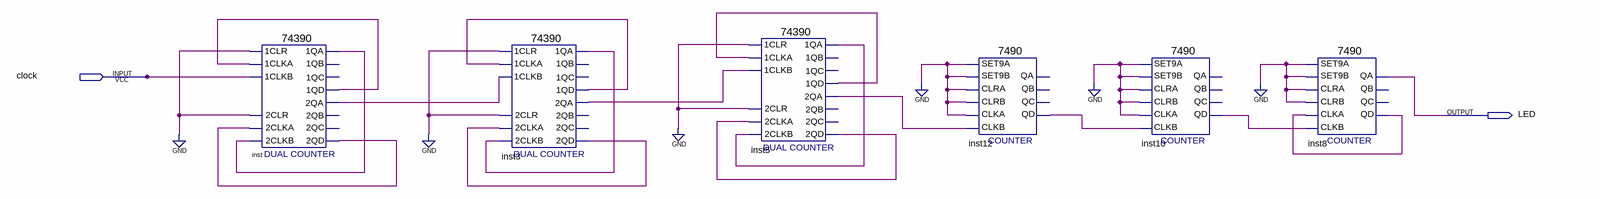
[diagram p0: schematic sheet]
// Quartus schematic Div02Hz5s.bdf as structural Verilog: 6 symbols, 2 pins
module Div02Hz5s (
  input  clock,
  output LED
);

  wire inst3_1qa, inst3_1qd, inst3_2qa, inst3_2qd, inst5_1qa, inst5_1qd, inst5_2qa, inst5_2qd, inst8_qd,
       inst10_qd, inst12_qd, inst_1qa, inst_1qd, inst_2qa, inst_2qd;

  \74390  inst (
    .\2CLKA (inst_2qd), .\2CLR (1'b0), .\2CLKB (inst_1qa), .\1CLR (1'b0), .\1CLKA (inst_1qd),
    .\1CLKB (clock), .\1QA (inst_1qa), .\1QD (inst_1qd), .\2QA (inst_2qa), .\2QD (inst_2qd));  // open: 1QB, 1QC, 2QB, 2QC
  \74390  inst3 (
    .\2CLKA (inst3_2qd), .\2CLR (1'b0), .\2CLKB (inst3_1qa), .\1CLR (1'b0), .\1CLKA (inst3_1qd),
    .\1CLKB (inst_2qa), .\1QA (inst3_1qa), .\1QD (inst3_1qd), .\2QA (inst3_2qa), .\2QD (inst3_2qd));  // open: 1QB, 1QC, 2QB, 2QC
  \74390  inst5 (
    .\2CLKA (inst5_2qd), .\2CLR (1'b0), .\2CLKB (inst5_1qa), .\1CLR (1'b0), .\1CLKA (inst5_1qd),
    .\1CLKB (inst3_2qa), .\1QA (inst5_1qa), .\1QD (inst5_1qd), .\2QA (inst5_2qa), .\2QD (inst5_2qd));  // open: 1QB, 1QC, 2QB, 2QC
  \7490  inst12 (
    .SET9A(1'b0), .CLRA(1'b0), .SET9B(1'b0), .CLKB(inst5_2qa), .CLKA(1'b0), .CLRB(1'b0), .QD(inst12_qd));  // open: QA, QB, QC
  \7490  inst10 (
    .SET9A(1'b0), .CLRA(1'b0), .SET9B(1'b0), .CLKB(inst12_qd), .CLKA(1'b0), .CLRB(1'b0), .QD(inst10_qd));  // open: QA, QB, QC
  \7490  inst8 (
    .SET9A(1'b0), .CLRA(1'b0), .SET9B(1'b0), .CLKB(inst10_qd), .CLKA(inst8_qd), .CLRB(1'b0), .QD(inst8_qd),
    .QA(LED));  // open: QB, QC
endmodule
